# Altium project 3 Phase ESC.PrjPcb
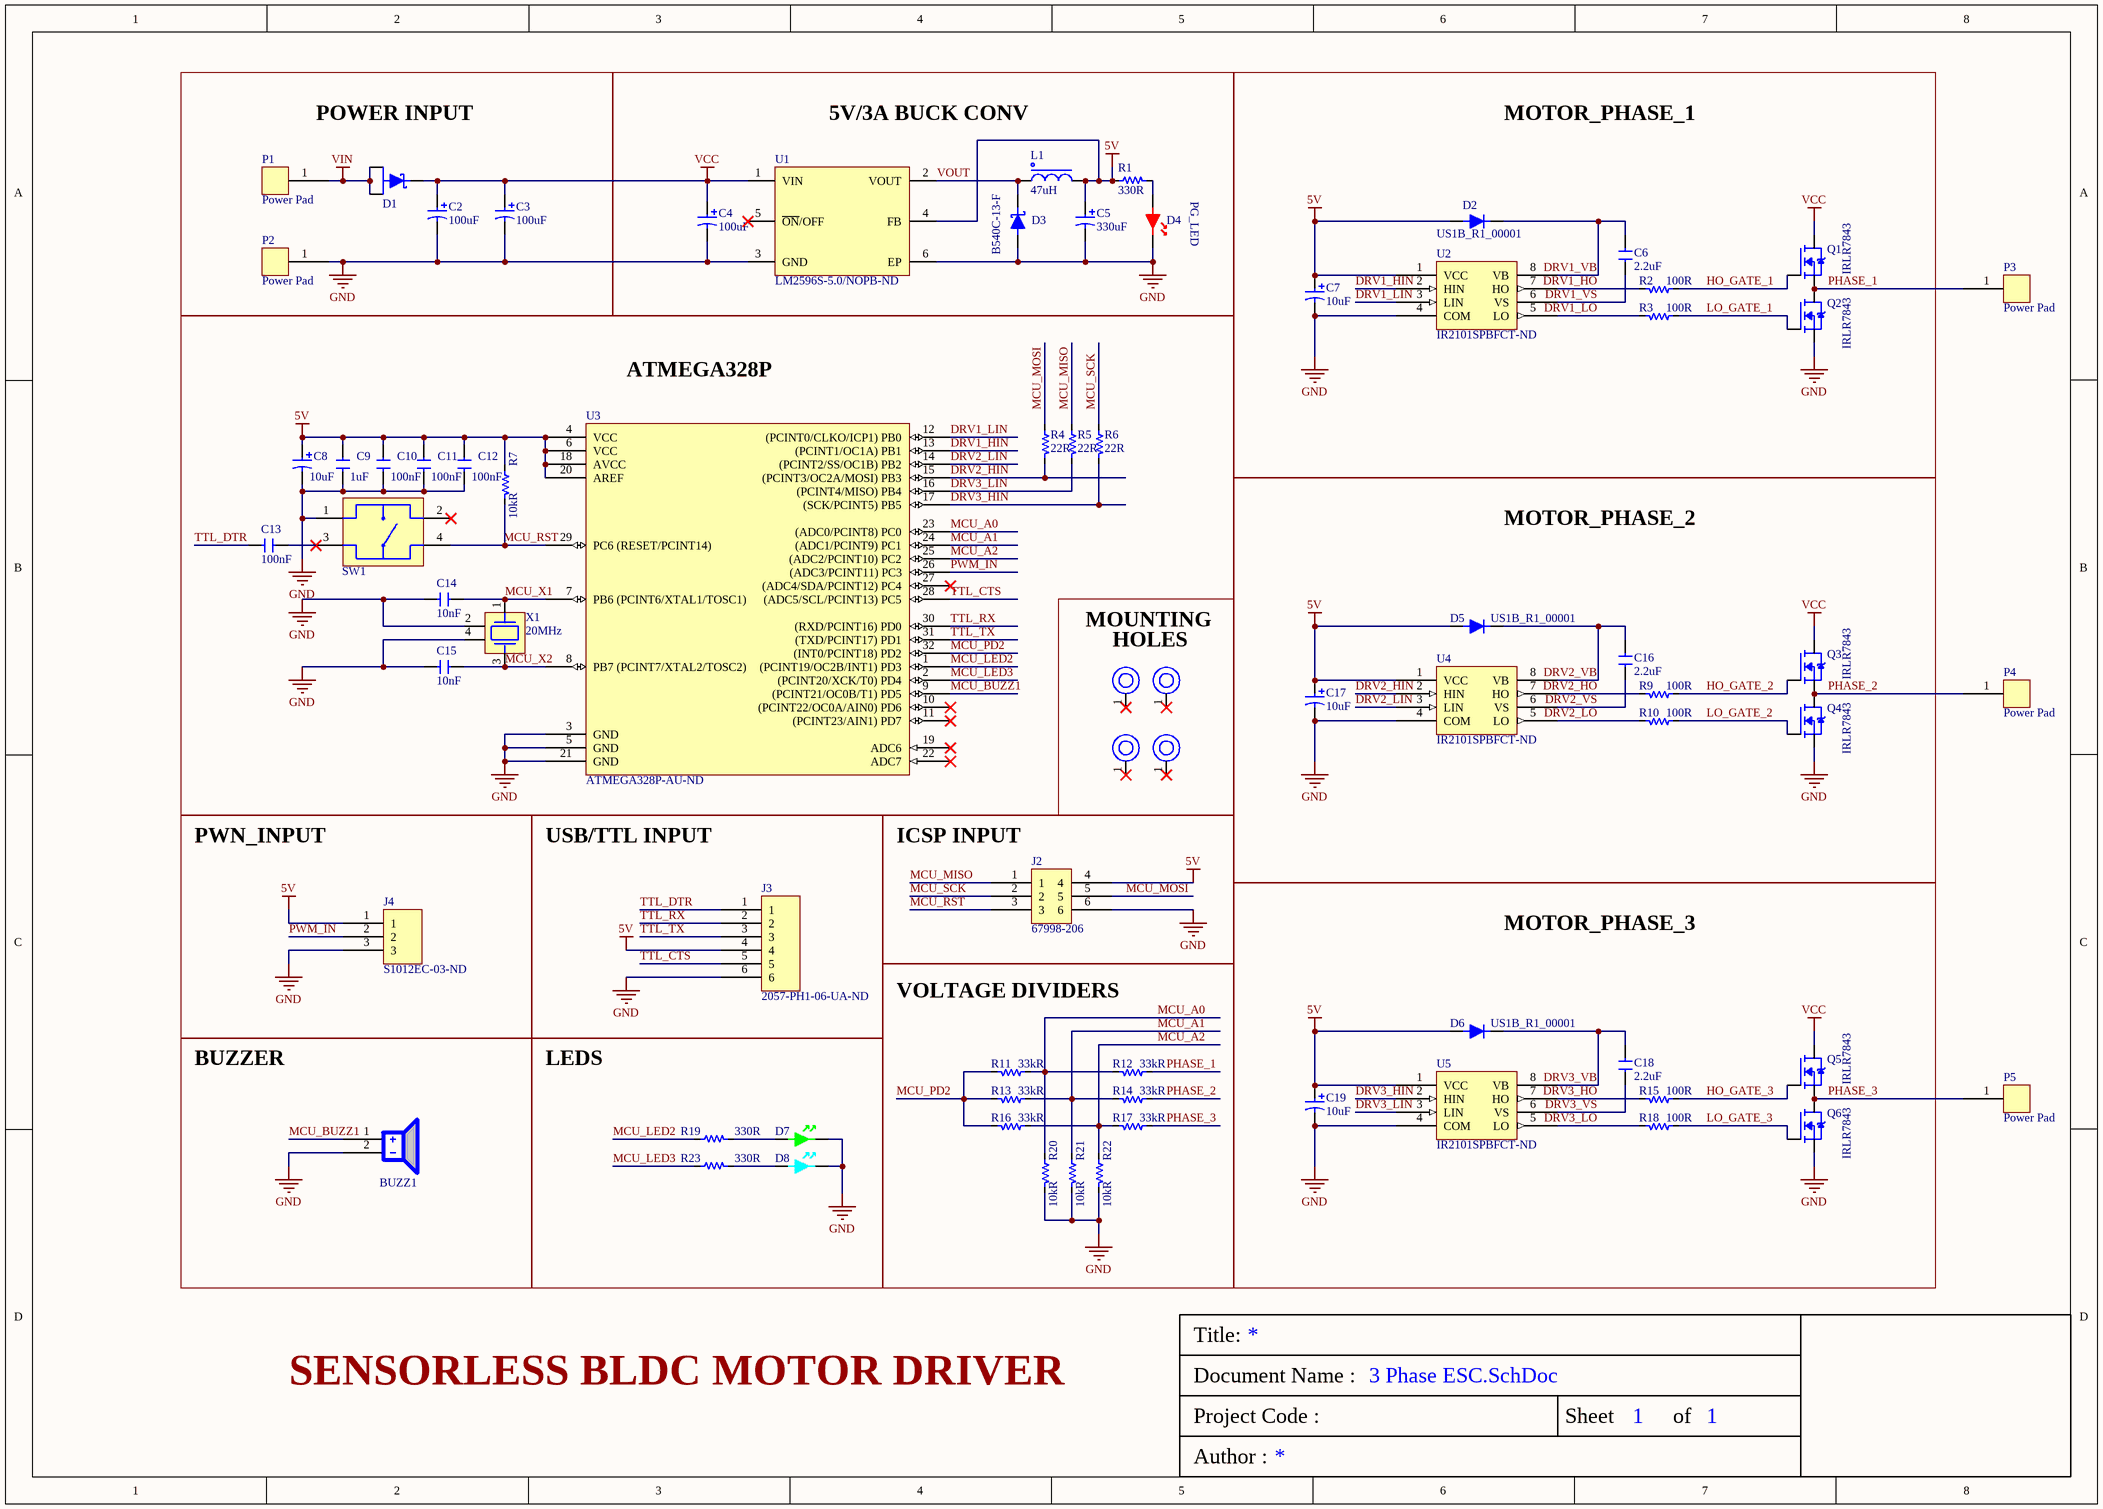
[diagram p0: 3 Phase ESC.SchDoc]
1 sheet, 75 parts. Net scope: global (net labels, ports and power ports of the same name join across sheets).
Board file: 3 Phase ESC.PcbDoc

## Sheet 3 Phase ESC.SchDoc
size A3; SheetNumber: 1; SheetTotal: 1

### Parts
BUZZ1  BUZZER  [BUZZER]  (value not drawn)
C2  Capacitance: 100uF  [RADIAL-2_10.00MMX10.00MM]  (hidden comment: BXJ63VC100MJ10TP)
C3  Capacitance: 100uF  [RADIAL-2_10.00MMX10.00MM]  (hidden comment: BXJ63VC100MJ10TP)
C4  Capacitance: 100uF  [RADIAL-2_10.00MMX10.00MM]  (hidden comment: BXJ63VC100MJ10TP)
C5  Capacitance: 330uF  [RADIAL-2_10.00MMX10.00MM]  (hidden comment: BDS35VC330MJ10TP)
C6  2.2uF  [0805_CAP]
C7  Capacitance: 10uF  [1206_TANT_CAP]  (hidden comment: CAP_10uF_10%_1206_10V_TANT)
C8  Capacitance: 10uF  [1206_TANT_CAP]  (hidden comment: CAP_10uF_10%_1206_10V_TANT)
C9  1uF  [0805_CAP]
C10  Capacitance: 100nF  [0805_CAP]  (hidden comment: CAP_0.1uF_%20_50V_0805_X7R_CER)
C11  Capacitance: 100nF  [0805_CAP]  (hidden comment: CAP_0.1uF_%20_50V_0805_X7R_CER)
C12  Capacitance: 100nF  [0805_CAP]  (hidden comment: CAP_0.1uF_%20_50V_0805_X7R_CER)
C13  Capacitance: 100nF  [0805_CAP]  (hidden comment: CAP_0.1uF_%20_50V_0805_X7R_CER)
C14  Capacitance: 10nF  [0805_CAP]  (hidden comment: CAP_10nF_%5_50V_0805_C0G_CER)
C15  Capacitance: 10nF  [0805_CAP]  (hidden comment: CAP_10nF_%5_50V_0805_C0G_CER)
C16  2.2uF  [0805_CAP]
C17  Capacitance: 10uF  [1206_TANT_CAP]  (hidden comment: CAP_10uF_10%_1206_10V_TANT)
C18  2.2uF  [0805_CAP]
C19  Capacitance: 10uF  [1206_TANT_CAP]  (hidden comment: CAP_10uF_10%_1206_10V_TANT)
D1  Diode 45V/40A  [DPAK275P1410X480-3N]  (value not drawn)
D2  Manufacturer Part Number: US1B_R1_00001  [DIOM5226X220N-SMA]  (hidden comment: DIODE_GENERAL_100V_1A_SMA)
D3  Manufacturer Part Number: B540C-13-F  [DIOM6959X25M_B560C-13-F]  (hidden comment: DIODE_SCHOTTKY_40V_5A_SMC)
D4  Red  [DIOC2114X07N-0805-LED-RED]  (value not drawn)
D5  Manufacturer Part Number: US1B_R1_00001  [DIOM5226X220N-SMA]  (hidden comment: DIODE_GENERAL_100V_1A_SMA)
D6  Manufacturer Part Number: US1B_R1_00001  [DIOM5226X220N-SMA]  (hidden comment: DIODE_GENERAL_100V_1A_SMA)
D7  Green  [DIOC2114X07N-0805-LED-GREEN]  (value not drawn)
D8  Blue  [DIOC2114X07N-0805-LED-BLUE]  (value not drawn)
J2  Supplier Part Number 1: 67998-206  [DIP_2X3_MALE_HEADER_2.54_PITCH]  (hidden comment: 2x3 Male HDR)
J3  Supplier Part Number 1: 2057-PH1-06-UA-ND  [DIP_1X6_MALE_HEADER_2.54_PITCH]  (hidden comment: 1x6 Male HDR)
J4  Supplier Part Number 1: S1012EC-03-ND  [DIP_1X3_MALE_HEADER_2.54_PITCH]  (hidden comment: CONN_1X3_2.54mm_Male Header)
L1  Inductance: 47uH  [INDP120120X800N]  (hidden comment: IND_47uH_4.3A_100mOHM_12X12MM_SMD)
MH1  Mounting Hole  [MOUNTING_HOLE]  (value not drawn)
MH2  Mounting Hole  [MOUNTING_HOLE]  (value not drawn)
MH3  Mounting Hole  [MOUNTING_HOLE]  (value not drawn)
MH4  Mounting Hole  [MOUNTING_HOLE]  (value not drawn)
P1  Power Pad  [POWER_SOLDER_PAD]  (no BOM)
P2  Power Pad  [POWER_SOLDER_PAD]  (no BOM)
P3  Power Pad  [POWER_SOLDER_PAD]  (no BOM)
P4  Power Pad  [POWER_SOLDER_PAD]  (no BOM)
P5  Power Pad  [POWER_SOLDER_PAD]  (no BOM)
Q1  IRLR7843  [DPAK229P991X239-3N]
Q2  IRLR7843  [DPAK229P991X239-3N]
Q3  IRLR7843  [DPAK229P991X239-3N]
Q4  IRLR7843  [DPAK229P991X239-3N]
Q5  IRLR7843  [DPAK229P991X239-3N]
Q6  IRLR7843  [DPAK229P991X239-3N]
R1  Resistance: 330R  [0805_RES]  (hidden comment: RES_330 OHM_5%_0805_1/8W)
R2  Resistance: 100R  [0805_RES]  (hidden comment: RES_100 OHM_1%_0805_1/8W)
R3  Resistance: 100R  [0805_RES]  (hidden comment: RES_100 OHM_1%_0805_1/8W)
R4  Resistance: 22R  [0805_RES]  (hidden comment: RES_22 OHM_1%_1/8W_0805)
R5  Resistance: 22R  [0805_RES]  (hidden comment: RES_22 OHM_1%_1/8W_0805)
R6  Resistance: 22R  [0805_RES]  (hidden comment: RES_22 OHM_1%_1/8W_0805)
R7  Resistance: 10kR  [0805_RES]  (hidden comment: 10k Ohms)
R9  Resistance: 100R  [0805_RES]  (hidden comment: RES_100 OHM_1%_0805_1/8W)
R10  Resistance: 100R  [0805_RES]  (hidden comment: RES_100 OHM_1%_0805_1/8W)
R11  Resistance: 33kR  [0805_RES]  (hidden comment: RES_33K OHM_1%_0805_1/8W)
R12  Resistance: 33kR  [0805_RES]  (hidden comment: RES_33K OHM_1%_0805_1/8W)
R13  Resistance: 33kR  [0805_RES]  (hidden comment: RES_33K OHM_1%_0805_1/8W)
R14  Resistance: 33kR  [0805_RES]  (hidden comment: RES_33K OHM_1%_0805_1/8W)
R15  Resistance: 100R  [0805_RES]  (hidden comment: RES_100 OHM_1%_0805_1/8W)
R16  Resistance: 33kR  [0805_RES]  (hidden comment: RES_33K OHM_1%_0805_1/8W)
R17  Resistance: 33kR  [0805_RES]  (hidden comment: RES_33K OHM_1%_0805_1/8W)
R18  Resistance: 100R  [0805_RES]  (hidden comment: RES_100 OHM_1%_0805_1/8W)
R19  Resistance: 330R  [0805_RES]  (hidden comment: RES_330 OHM_5%_0805_1/8W)
R20  Resistance: 10kR  [0805_RES]  (hidden comment: 10k Ohms)
R21  Resistance: 10kR  [0805_RES]  (hidden comment: 10k Ohms)
R22  Resistance: 10kR  [0805_RES]  (hidden comment: 10k Ohms)
R23  Resistance: 330R  [0805_RES]  (hidden comment: RES_330 OHM_5%_0805_1/8W)
SW1  SWITCH_TACTILE_SPST-NO_0.05A_12V  [TACT_SWITCH_6MMX6MM]  (value not drawn)
U1  Supplier Part Number 1: LM2596S-5.0/NOPB-ND  [TO170P1524X483-6N]  (hidden comment: PMIC_LM2596S-5.0/NOPB)
U2  Supplier Part Number 1: IR2101SPBFCT-ND  [SOIC127P599X175-8N]  (hidden comment: DRIVER_IR2101)
U3  Supplier Part Number 1: ATMEGA328P-AU-ND  [ATmega8U2_QFP127P600-8N]  (hidden comment: ATMEGA328P_AU)
U4  Supplier Part Number 1: IR2101SPBFCT-ND  [SOIC127P599X175-8N]  (hidden comment: DRIVER_IR2101)
U5  Supplier Part Number 1: IR2101SPBFCT-ND  [SOIC127P599X175-8N]  (hidden comment: DRIVER_IR2101)
X1  20MHz  [4-SMD_CMOS_OSC_2.50MMX2.00]

### Blocks framed on the sheet
POWER INPUT: C2 C3 D1 P1 P2
5V/3A BUCK CONV: C4 C5 D3 D4 L1 R1 U1
MOTOR_PHASE_1: C6 C7 D2 Q1 Q2 R2 R3 U2
MOTOR_PHASE_2: C16 C17 D5 Q3 Q4 R9 R10 U4
PWN_INPUT: J4
USB/TTL INPUT: J3
ICSP INPUT: J2
MOTOR_PHASE_3: C18 C19 D6 Q5 Q6 R15 R18 U5
VOLTAGE DIVIDERS: R11-R14 R16 R17 R20-R22
BUZZER: BUZZ1
LEDS: D7 D8 R19 R23

### Nets
5V: C5.1 C7.1 C8.1 C9.2 C10.2 C11.2 C12.2 C17.1 C19.1 D2.2(ANODE) D5.2(ANODE) D6.2(ANODE) J2.4 J3.4 J4.1 L1.2 R1.2 R7.2 U1.4(FB) U2.1(VCC) U3.4(VCC) U3.6(VCC) U3.18(AVCC) U3.20(AREF) U4.1(VCC) U5.1(VCC)
GND: BUZZ1.2(-) C2.2 C3.2 C4.2 C5.2 C7.2 C8.2 C9.1 C10.1 C11.1 C12.1 C14.1 C15.1 C17.2 C19.2 D3.2(ANODE) D4.1(CATHODE) D7.1(CATHODE) D8.1(CATHODE) J2.6 J3.6 J4.3 P2.1 Q2.3(S) Q4.3(S) Q6.3(S) R20.1 R21.1 R22.1 SW1.1 U1.3(GND) U1.6(EP) U2.4(COM) U3.3(GND) U3.5(GND) U3.21(GND) U4.4(COM) U5.4(COM) X1.2(GND) X1.4(GND)
VCC: C2.1 C3.1 C4.1 D1.4(CATHODE) Q1.4(D) Q3.4(D) Q5.4(D) U1.1(VIN)
VIN: D1.1(ANODE) D1.3(ANODE) P1.1
DRV1_HIN: U2.2(HIN) U3.13((PCINT1/OC1A)_PB1)
DRV1_HO: R2.1 U2.7(HO)
DRV1_LIN: U2.3(LIN) U3.12((PCINT0/CLKO/ICP1)_PB0)
DRV1_LO: R3.1 U2.5(LO)
DRV1_VB: C6.1 D2.1(CATHODE) U2.8(VB)
DRV1_VS: C6.2 U2.6(VS)
DRV2_HIN: R4.1 U3.15((PCINT3/OC2A/MOSI)_PB3) U4.2(HIN)
DRV2_HO: R9.1 U4.7(HO)
DRV2_LIN: U3.14((PCINT2/SS/OC1B)_PB2) U4.3(LIN)
DRV2_LO: R10.1 U4.5(LO)
DRV2_VB: C16.1 D5.1(CATHODE) U4.8(VB)
DRV2_VS: C16.2 U4.6(VS)
DRV3_HIN: R6.1 U3.17((SCK/PCINT5)_PB5) U5.2(HIN)
DRV3_HO: R15.1 U5.7(HO)
DRV3_LIN: R5.1 U3.16((PCINT4/MISO)_PB4) U5.3(LIN)
DRV3_LO: R18.1 U5.5(LO)
DRV3_VB: C18.1 D6.1(CATHODE) U5.8(VB)
DRV3_VS: C18.2 U5.6(VS)
HO_GATE_1: Q1.1(G) R2.2
HO_GATE_2: Q3.1(G) R9.2
HO_GATE_3: Q5.1(G) R15.2
LO_GATE_1: Q2.1(G) R3.2
LO_GATE_2: Q4.1(G) R10.2
LO_GATE_3: Q6.1(G) R18.2
MCU_A0: R11.2 R12.1 R20.2 U3.23((ADC0/PCINT8)_PC0)
MCU_A1: R13.2 R14.1 R21.2 U3.24((ADC1/PCINT9)_PC1)
MCU_A2: R16.2 R17.1 R22.2 U3.25((ADC2/PCINT10)_PC2)
MCU_BUZZ1: BUZZ1.1(+) U3.9((PCINT21/OC0B/T1)_PD5)
MCU_LED2: R19.2 U3.1((PCINT19/OC2B/INT1)_PD3)
MCU_LED3: R23.2 U3.2((PCINT20/XCK/T0)_PD4)
MCU_MISO: J2.1 R5.2
MCU_MOSI: J2.5 R4.2
MCU_PD2: R11.1 R13.1 R16.1 U3.32((INT0/PCINT18)_PD2)
MCU_RST: J2.3 R7.1 SW1.4 U3.29(PC6_(RESET/PCINT14))
MCU_SCK: J2.2 R6.2
MCU_X1: C14.2 U3.7(PB6_(PCINT6/XTAL1/TOSC1)) X1.1
MCU_X2: C15.2 U3.8(PB7_(PCINT7/XTAL2/TOSC2)) X1.3
PHASE_1: P3.1 Q1.3(S) Q2.4(D) R12.2
PHASE_2: P4.1 Q3.3(S) Q4.4(D) R14.2
PHASE_3: P5.1 Q5.3(S) Q6.4(D) R17.2
PWM_IN: J4.2 U3.26((ADC3/PCINT11)_PC3)
TTL_CTS: J3.5 U3.28((ADC5/SCL/PCINT13)_PC5)
TTL_DTR: C13.2 J3.1
TTL_RX: J3.2 U3.30((RXD/PCINT16)_PD0)
TTL_TX: J3.3 U3.31((TXD/PCINT17)_PD1)
VOUT: D3.1(CATHODE) L1.1 U1.2(VOUT)
NetC13_1: C13.1 SW1.3
NetD4_2: D4.2(ANODE) R1.1
NetD7_2: D7.2(ANODE) R19.1
NetD8_2: D8.2(ANODE) R23.1

Not connected (* = marked no-connect by the designer): MH1 1*; MH2 1*; MH3 1*; MH4 1*; SW1 2*; U1 5(~{ON}/OFF)*; U3 10((PCINT22/OC0A/AIN0)_PD6)* 11((PCINT23/AIN1)_PD7)* 19(ADC6)* 22(ADC7)* 27((ADC4/SDA/PCINT12)_PC4)*

### Notes on the sheet
- PG_LED
- ATMEGA328P
- MOUNTING
- HOLES
- SENSORLESS BLDC MOTOR DRIVER
- Title:
- Document Name :
- Project Code :
- Sheet
- of
- Author :

### Library data of the parts
C2-C4 = CAP_100uF_20%_63V_SMD_ALUM: CAP.EL.100uF 63V 10x10 105C 5000Hrs SMD; Manufacturer: SAMYOUNG; Tolerance: %20; Ripple Current: 350mA; Voltage Rating: 63V; Dimensions: 10mmx10mm
C5 = CAP_330uF_20%_35V_SMD_ALUM: CAP.EL.330uF 35V 10x10 105C 2000Hrs SMD; Manufacturer: SAMYOUNG; Tolerance: %20; Ripple Current: 450mA; Voltage Rating: 35V; Dimensions: 10mmx10mm
C6 C16 C18 = CAP_2.2uF_%10_25V_0805_X5R_CER: CAP CER 2.2UF 25V X5R 0805; Manufacturer: Samsung; Manufacturer Part Number: CL21A225KAFNNNE; Tolerance: 10%; Supplier 1: Digi-Key; RoHS: Yes; Category: Ceramic Capacitors; Stock 1: 282255; Pricing 1: 1=0,13000, 10=0,09300, 50=0,05280, 100=0,04380, 500=0,03070, 1000=0,02541 (USD); Mount: Surface Mount; Case/Package: 0805; Case Code (Metric): 2012; Case Code (Imperial): 0805; Min Operating Temperature: -55°C; Max Operating Temperature: 85°C; Capacitance: 2.2uF; Packaging: Tape and Reel; Package Quantity: 1; Voltage Rating: 25V; Dielectric: X5R; Series: CL; Construction: Flat; Length: 2mm; Width: 0.049inch; Height: 1.25mm; Thickness: 0.053inch; Depth: 1.25mm; Radiation Hardening: No; RoHS Compliant: Yes; ComponentLink1URL: https://datasheet.ciiva.com/25798/cl21a225kafnnne-25798496.pdf?src-supplier=Digi-Key; ComponentLink1Description: https://datasheet.ciiva.com/25798/cl21a225kafnnne-25798496.pdf?src-supplier=Digi-Key; ComponentLink2URL: https://datasheet.ciiva.com/16425/samsung20passive20cl21a225kafnnne-16425804.pdf?src-supplier=Future+Electronics; ComponentLink2Description: https://datasheet.ciiva.com/16425/samsung20passive20cl21a225kafnnne-16425804.pdf?src-supplier=Future+Electronics; ComponentLink3URL: https://datasheet.ciiva.com/26838/getdatasheetpartid-745307-26838602.pdf?src-supplier=Verical; ComponentLink3Description: https://datasheet.ciiva.com/26838/getdatasheetpartid-745307-26838602.pdf?src-supplier=Verical; Supplier Part Number 1: 1276-1763-1-ND
C7 C8 C17 C19 = CAP_10uF_10%_1206_10V_TANT: Cap Tant Solid 10uF 10V A CASE 10% (3.2 X 1.6 X 1.6mm) Inward L SMD 3216-18 3 Ohm 125C T/R; Manufacturer: Kyocera AVX; Manufacturer Part Number: TAJA106K010SNJ; ESR (Equivalent Series Resistance): 3R; Leakage Current: 1uA; Polarity: Polar; Dissipation Factor: 6%; Supplier 1: Digi-Key; RoHS: Yes; Category: Tantalum Capacitors; Stock 1: 14579; Pricing 1: 1=0,31000, 10=0,21300, 50=0,14920, 100=0,12780, 500=0,09584, 1000=0,08094, 2500=0,07668 (USD); Case/Package: Molded; Number of Pins: 2; Case Code (Imperial): 1206; Case Code (Metric): 3216; Min Operating Temperature: -55°C; Max Operating Temperature: 125°C; Tolerance: 10%; Packaging: Tape and Reel; Voltage Rating: 10V; Package Quantity: 8000; Termination: SMD/SMT; Voltage Rating (DC): 10V; Series: TAJ; Construction: Flat; Length: 3.2mm; Width: 1.6mm; Height: 1.8mm; Depth: 1.6mm; Radiation Hardening: No; Lead Free: Lead Free; RoHS Compliant: Yes; ComponentLink1URL: https://datasheet.ciiva.com/12909/taj-27497-12909898.pdf?src-supplier=Mouser; ComponentLink1Description: https://datasheet.ciiva.com/12909/taj-27497-12909898.pdf?src-supplier=Mouser; Supplier Part Number 1: 478-13122-1-ND
C9 = CAP_1uF_%10_25V_0805_X7R_CER: 陶瓷电容 1uF(105) 1uF ±10% 25V 0805; Manufacturer: Samsung; Manufacturer Part Number: CL21B105KAFNNNG; Material: Ceramic; Dielectric: X7R; Supplier 1: Digi-Key; RoHS: Yes; Category: Ceramic Capacitors; Stock 1: 509034; Pricing 1: 1=0,10000, 10=0,07100, 50=0,03880, 100=0,03170, 500=0,02264, 1000=0,01779 (USD); Mount: Surface Mount; Case/Package: 0805; Case Code (Metric): 2012; Case Code (Imperial): 0805; Min Operating Temperature: -55°C; Max Operating Temperature: 125°C; Tolerance: 10%; Capacitance: 1uF; Voltage Rating: 25V; Package Quantity: 3000; Packaging: Tape and Reel; Voltage: 25V; Series: CL; Length: 2mm; Width: 0.049inch; Height: 1.25mm; Thickness: 0.053inch; Depth: 1.25mm; Radiation Hardening: No; RoHS Compliant: Yes; ComponentLink1URL: https://datasheet.ciiva.com/26920/getdatasheetpartid-698495-26920200.pdf?src-supplier=Verical; ComponentLink1Description: https://datasheet.ciiva.com/26920/getdatasheetpartid-698495-26920200.pdf?src-supplier=Verical; ComponentLink2URL: https://datasheet.ciiva.com/29199/455911-da-01-en-vs-kondensator-0805-29199043.pdf?src-supplier=Conrad; ComponentLink2Description: https://datasheet.ciiva.com/29199/455911-da-01-en-vs-kondensator-0805-29199043.pdf?src-supplier=Conrad; ComponentLink3URL: https://datasheet.ciiva.com/16428/cl05b104kq5nnnc-16428871.pdf?src-supplier=Future+Electronics; ComponentLink3Description: https://datasheet.ciiva.com/16428/cl05b104kq5nnnc-16428871.pdf?src-supplier=Future+Electronics; Supplier Part Number 1: 1276-6469-1-ND
C10-C13 = CAP_0.1uF_%20_50V_0805_X7R_CER: Cap Ceramic 0.1uF 50V X7R 20% SMD 0805 125C Paper T/R; Manufacturer: KEMET; Manufacturer Part Number: C0805C104M5RACTU; Supplier 1: Digi-Key; RoHS: Yes; Category: Ceramic Capacitors; Stock 1: 4863; Pricing 1: 1=0,10000, 10=0,06400, 50=0,03500, 100=0,02860, 500=0,02040, 1000=0,01603 (USD); Mount: Surface Mount; Case/Package: 0805; Dielectric Material: Ceramic; Min Operating Temperature: -55°C; Max Operating Temperature: 125°C; Tolerance: 20%; Dielectric: X7R; Packaging: Tape and Reel; Voltage Rating (DC): 50V; Length: 2mm; Height: 0.9mm; Depth: 1.25mm; Radiation Hardening: No; ComponentLink1URL: http://uk.rs-online.com/webdocs/13da/0900766b813daa06.pdf?src-supplier=RSComponents; ComponentLink1Description: http://uk.rs-online.com/webdocs/13da/0900766b813daa06.pdf?src-supplier=RSComponents; ComponentLink2URL: https://www.verical.com/server-webapp/html/getDatasheet?partID=774625&src-supplier=Verical; ComponentLink2Description: https://www.verical.com/server-webapp/html/getDatasheet?partID=774625&src-supplier=Verical; ComponentLink3URL: http://www.farnell.com/datasheets/2739857.pdf?src-supplier=Farnell; ComponentLink3Description: http://www.farnell.com/datasheets/2739857.pdf?src-supplier=Farnell; ComponentLink4URL: http://uk.rs-online.com/webdocs/1515/0900766b81515223.pdf?src-supplier=RSComponents; ComponentLink4Description: http://uk.rs-online.com/webdocs/1515/0900766b81515223.pdf?src-supplier=RSComponents; ComponentLink5URL: http://components.arrow.com/part/dataview/0323_00324812?src-supplier=Arrow+Europe; ComponentLink5Description: http://components.arrow.com/part/dataview/0323_00324812?src-supplier=Arrow+Europe; ComponentLink6URL: http://uk.rs-online.com/webdocs/1528/0900766b81528e2f.pdf?src-supplier=RSComponents; ComponentLink6Description: http://uk.rs-online.com/webdocs/1528/0900766b81528e2f.pdf?src-supplier=RSComponents; ComponentLink7URL: http://www.farnell.com/datasheets/2739857.pdf?src-supplier=Newark; ComponentLink7Description: http://www.farnell.com/datasheets/2739857.pdf?src-supplier=Newark; ComponentLink8URL: http://www.alliedelec.com/m/d/9bfe7773041ffe9d406e68bc7b377fdd.pdf?src-supplier=Allied+Electronics; ComponentLink8Description: http://www.alliedelec.com/m/d/9bfe7773041ffe9d406e68bc7b377fdd.pdf?src-supplier=Allied+Electronics; ComponentLink9URL: https://api.kemet.com/component-edge/download/datasheet/C0805C104M5RACTU.pdf?src-supplier=Digi-Key; ComponentLink9Description: https://api.kemet.com/component-edge/download/datasheet/C0805C104M5RACTU.pdf?src-supplier=Digi-Key; ComponentLink10URL: http://capacitoredge.kemet.com/capedge2/DataSheet?pn=C0805C104M5RACTU&src-supplier=Avnet+Europe; ComponentLink10Description: http://capacitoredge.kemet.com/capedge2/DataSheet?pn=C0805C104M5RACTU&src-supplier=Avnet+Europe; ComponentLink11URL: http://www.farnell.com/datasheets/2739857.pdf?src-supplier=Element14; ComponentLink11Description: http://www.farnell.com/datasheets/2739857.pdf?src-supplier=Element14; ComponentLink12URL: http://www.mouser.com/ds/2/212/KEM_C1002_X7R_SMD-1102033.pdf?src-supplier=Mouser; ComponentLink12Description: http://www.mouser.com/ds/2/212/KEM_C1002_X7R_SMD-1102033.pdf?src-supplier=Mouser; ComponentLink13URL: https://www.verical.com/server-webapp/html/getDatasheet?partID=91523&src-supplier=Verical; ComponentLink13Description: https://www.verical.com/server-webapp/html/getDatasheet?partID=91523&src-supplier=Verical; ComponentLink14URL: http://components.arrow.com/part/dataview/2091108S8109171N7429?src-supplier=Arrow+Electronics; ComponentLink14Description: http://components.arrow.com/part/dataview/2091108S8109171N7429?src-supplier=Arrow+Electronics; Supplier Part Number 1: 399-C0805C104M5RAC7800CT-ND
C14 C15 = CAP_10nF_%5_50V_0805_C0G_CER: CGA Series 0805 10 nF 50 V ±5 % Tolerance C0G SMT Multilayer Ceramic Capacitor; Manufacturer: TDK; Manufacturer Part Number: CGA4C2C0G1H103J060AA; Tolerance: 5%; Voltage Rating: 50V; Supplier 1: Digi-Key; RoHS: Yes; Category: Ceramic Capacitors; Stock 1: 35061; Pricing 1: 1=0,32000, 10=0,21800, 50=0,14520, 100=0,12340, 500=0,08712, 1000=0,07623 (USD); Mount: Surface Mount; Case/Package: 0805; Case Code (Metric): 2012; Case Code (Imperial): 0805; Weight: 0.000194oz; Min Operating Temperature: -55°C; Max Operating Temperature: 125°C; Packaging: Tape and Reel; Package Quantity: 1; Voltage Rating (DC): 50V; Dielectric: C0G; Termination: SMD/SMT; Resistor Type: Ceramic; Series: CGA; Length: 2mm; Width: 0.049inch; Height: 0.6mm; Thickness: 0.028inch; Depth: 1.25mm; Ratings: AEC-Q200; Radiation Hardening: No; REACH SVHC: No SVHC; Lead Free: Lead Free; RoHS Compliant: Yes; ComponentLink1URL: https://datasheet.ciiva.com/15215/getdatasheetpartid-712412-15215921.pdf?src-supplier=Verical; ComponentLink1Description: https://datasheet.ciiva.com/15215/getdatasheetpartid-712412-15215921.pdf?src-supplier=Verical; ComponentLink2URL: https://datasheet.ciiva.com/24219/cga4c2c0g1h103j060aa-265903-24219348.pdf?src-supplier=Mouser; ComponentLink2Description: https://datasheet.ciiva.com/24219/cga4c2c0g1h103j060aa-265903-24219348.pdf?src-supplier=Mouser; Supplier Part Number 1: 445-6947-1-ND
D1 = DIODE_SCHOTTKY_45V_40A_TO263: Diode Schottky 45V 40A 3-Pin TO-263 T/R; Manufacturer: Panjit; Manufacturer Part Number: SBM4045LDC_R2_00001; Supplier 1: Mouser; Pricing 1: 1=1,48000, 10=1,34000, 50=1,34000, 100=1,04000, 1000=0,67700, 10000=0,63100 (USD); Supplier Part Number 1: 241-SBM4045LDCR20000
D2 D5 D6 = DIODE_GENERAL_100V_1A_SMA: Si-diode 1A 100V Sma; Manufacturer: Pan Jit; Max Reverse Current: 1uA; Reverse Recovery Time: 50ns; Peak Non-Repetitive Surge Current: 30A; Element Configuration: Single; Supplier 1: Digi-Key; RoHS: Yes; Category: Rectifier Diodes; Stock 1: 5400; Pricing 1: 1=0,42000, 10=0,34100, 100=0,18060, 500=0,11880 (USD); Mount: Surface Mount; Case/Package: SMA; Min Operating Temperature: -55°C; Max Operating Temperature: 150°C; Forward Current: 1A; Max Repetitive Reverse Voltage (Vrrm): 100V; RoHS Compliant: Yes; Supplier Part Number 1: 3757-US1B_R1_00001CT-ND
D3 = DIODE_SCHOTTKY_40V_5A_SMC: VR=40V IF=5A 300pF; Manufacturer: Diodes; Forward Current: 5A; Max Repetitive Reverse Voltage (Vrrm): 40V; Element Configuration: Single; Max Reverse Current: 500uA; Peak Non-Repetitive Surge Current: 100A; Forward Voltage: 550mV; Polarity: Standard; Supplier 1: Digi-Key; RoHS: Yes; Category: Rectifier Diodes; Mount: Surface Mount; Case/Package: SMC; Number of Pins: 2; Weight: 0.007408oz; Contact Plating: Tin,Matte; Min Operating Temperature: -55°C; Max Operating Temperature: 125°C; Packaging: Cut Tape; Max Forward Surge Current (Ifsm): 100A; Package Quantity: 3000; Average Rectified Current: 5A; Termination: SMD/SMT; Voltage Rating (DC): 40V; Current Rating: 5A; Capacitance: 300pF; Output Current: 5A; Max Reverse Voltage (DC): 40V; Series: B520C/CQ - B560C/CQ; Current: 5A; Voltage: 40V; Length: 7.11mm; Width: 6.22mm; Height: 2.5mm; Radiation Hardening: No; REACH SVHC: No SVHC; Lead Free: Lead Free; RoHS Compliant: Yes; Supplier Part Number 1: B540C-FDICT-ND
D4 = LED_RED CLEAR_2SMD/0805: Led Red Clear 2SMD; Manufacturer: Everlight; Manufacturer Part Number: EAST2012RA1; Lens Color: Colorless; Luminous Intensity: 79mcd; Test Current: 20mA; Viewing Angle: 120°; Dominant Wavelength: 626nm; Forward Voltage: 2V; Supplier 1: Digi-Key; Category: LEDs; Stock 1: 154; Pricing 1: 1=0,23000, 10=0,12300, 100=0,05840, 500=0,04996, 1000=0,03842 (USD); Mount: Surface Mount; Case/Package: 0805; Color: Red; Packaging: Tape and Reel; Lens Transparency: Clear; Length: 2mm; Width: 1.25mm; Height: 1mm; RoHS Compliant: Yes; ComponentLink1URL: http://www.mouser.com/ds/2/143/EAST2012RA1-707412.pdf?src-supplier=Mouser; ComponentLink1Description: http://www.mouser.com/ds/2/143/EAST2012RA1-707412.pdf?src-supplier=Mouser; ComponentLink2URL: https://everlightamericas.com/index.php?controller=attachment&id_attachment=1047&src-supplier=Digi-Key; ComponentLink2Description: https://everlightamericas.com/index.php?controller=attachment&id_attachment=1047&src-supplier=Digi-Key; Supplier Part Number 1: 1080-EAST2012RA1CT-ND
D7 = LED_GREEN CLEAR_2SMD/0805: Led Green Clear 2SMD; Manufacturer: Everlight; Manufacturer Part Number: EAST2012GA5; Lens Color: Colorless; Luminous Intensity: 315mcd; Test Current: 20mA; Viewing Angle: 140°; Dominant Wavelength: 523nm; Forward Voltage: 3.4V; Supplier 1: Digi-Key; Category: LEDs; Stock 1: 15531; Pricing 1: 1=0,44000, 10=0,29000, 100=0,19380, 500=0,13406, 1000=0,11172 (USD); Mount: Surface Mount; Case/Package: 0805; Color: Green; Packaging: Tape and Reel; Lens Transparency: Clear; Length: 2mm; Width: 1.25mm; Height: 1mm; RoHS Compliant: Yes; ComponentLink1URL: http://www.mouser.com/ds/2/143/EAST2012GA5-707028.pdf?src-supplier=Mouser; ComponentLink1Description: http://www.mouser.com/ds/2/143/EAST2012GA5-707028.pdf?src-supplier=Mouser; ComponentLink2URL: https://everlightamericas.com/index.php?controller=attachment&id_attachment=1042&src-supplier=Digi-Key; ComponentLink2Description: https://everlightamericas.com/index.php?controller=attachment&id_attachment=1042&src-supplier=Digi-Key; Supplier Part Number 1: 1080-EAST2012GA5CT-ND
D8 = LED_BLUE CLEAR_2SMD/0805: Blue 0805 140° 112 mcd Clear 3.3 V Surface Mount LED; Manufacturer: Everlight; Manufacturer Part Number: EAST2012BA2; Lens Color: Colorless; Luminous Intensity: 79mcd; Test Current: 20mA; Dominant Wavelength: 471nm; Forward Voltage: 3.3V; Supplier 1: Digi-Key; RoHS: Yes; Category: LEDs; Pricing 1: 9000=0,05724 (USD); Mount: Surface Mount; Case/Package: 0805; Color: Blue; Packaging: Tape and Reel; Lens Transparency: Clear; Viewing Angle: 140°; Length: 2mm; Width: 1.25mm; Height: 1.1mm; Lead Free: Lead Free; RoHS Compliant: Yes; ComponentLink1URL: http://www.mouser.com/ds/2/143/EAST2012BA2-707392.pdf?src-supplier=Mouser; ComponentLink1Description: http://www.mouser.com/ds/2/143/EAST2012BA2-707392.pdf?src-supplier=Mouser; ComponentLink2URL: https://everlightamericas.com/index.php?controller=attachment&id_attachment=1036&src-supplier=Digi-Key; ComponentLink2Description: https://everlightamericas.com/index.php?controller=attachment&id_attachment=1036&src-supplier=Digi-Key; Supplier Part Number 1: EAST2012BA2-ND
J2 = CONN_2X3_2.54mm_Male Header: Conn Unshrouded Header HDR 6 POS 2.54mm Solder ST Thru-Hole Poly Bag; Manufacturer: Amphenol ICC / FCI; Supplier 1: Avnet; Manufacturer Part Number: 67998-206; Category: Headers and Wire Housings; Pricing 1: 4800=0,21933, 5600=0,21344, 10400=0,20314, 24000=0,19578, 48000=0,18989, 240000=0,18400, 480000=0,17958 (USD); ComponentLink1URL: http://portal.fciconnect.com/Comergent//fci/drawing/67996.pdf?src-supplier=Digi-Key; ComponentLink1Description: http://portal.fciconnect.com/Comergent//fci/drawing/67996.pdf?src-supplier=Digi-Key; ComponentLink2URL: http://portal.fciconnect.com/Comergent/fci/drawing/67996.pdf?src-supplier=Avnet; ComponentLink2Description: http://portal.fciconnect.com/Comergent/fci/drawing/67996.pdf?src-supplier=Avnet
J3 = CONN_1X6_2.54m_Male Header: PH Series 6 Position Through Hole Single Row Straight .100 Header; Manufacturer: Adam Equipment; Manufacturer Part Number: PH1-06-UA; Number of Positions: 6; Pitch: 2.54mm; Supplier 1: Digi-Key; RoHS: Yes; Category: Connectors; Stock 1: 1029; Pricing 1: 1=0,13000, 10=0,10000, 100=0,07370, 500=0,06098, 1000=0,05336, 5000=0,04574, 10000=0,04447 (USD); Mount: Through Hole; Contact Plating: Gold; Number of Contacts: 6; Packaging: Bag; Number of Rows: 1; Lead Free: Lead Free; ComponentLink1URL: http://www.adam-tech.com/catalog/2012/page_312-315.pdf?src-supplier=Future+Electronics; ComponentLink1Description: http://www.adam-tech.com/catalog/2012/page_312-315.pdf?src-supplier=Future+Electronics
J4 = CONN_1X3_2.54mm_Male Header: Conn Header Vert 3POS 2.54MM; Manufacturer: Sullins; Manufacturer Part Number: PREC003SAAN-RC; Number of Positions: 3; Connector Type: Male Pin; Pitch: 0.1inch; Supplier 1: Digi-Key; RoHS: Yes; Category: Connectors; Stock 1: 15048; Pricing 1: 1=0,09000, 10=0,08400, 25=0,06240, 50=0,05340, 100=0,05170, 250=0,04456, 500=0,04276 (USD); Mount: Through Hole; Color: Black; Contact Plating: Tin; Package Quantity: 1; Number of Rows: 1; Packaging: Bulk; Termination: Solder; Series: -; Contact Type: Male Pin; Contact Mating Length: 0.23inch; RoHS Compliant: Yes; ComponentLink1URL: https://datasheet.ciiva.com/740/zrzczzzszzn-rc-st-11635-b-740842.pdf?src-supplier=Digi-Key; ComponentLink1Description: https://datasheet.ciiva.com/740/zrzczzzszzn-rc-st-11635-b-740842.pdf?src-supplier=Digi-Key
L1 = IND_47uH_4.3A_100mOHM_12X12MM_SMD: INDUCTOR POWER 47UH 12X12MM SMD; Manufacturer: CORE MASTER; Manufacturer Part Number: SRI1207-470M; Current Rating: 4.3A; Tolerance: 20%; DC Resistance (DCR): 100mR
MH1-MH4 = MOUNTING_HOLE
P1-P5 = POWER_PAD
Q1-Q6 = MOSFET_IRLR7843TRPBF: MOSFET N-CH 30V 161A DPAK; Manufacturer: Infineon; Rds On Max: 3.3mR; Input Capacitance: 4.38nF; Max Power Dissipation: 140W; Rise Time: 42ns; Gate to Source Voltage (Vgs): 20V; Turn-Off Delay Time: 34ns; Turn-On Delay Time: 25ns; Threshold Voltage: 2.3V; Supplier 1: Digi-Key; Manufacturer Part Number: IRLR7843TRPBF; RoHS: Yes; Category: MOSFETs; Stock 1: 5978; Pricing 1: 1=1,73000, 10=1,54800, 100=1,20670, 500=0,99682, 1000=0,87440 (USD); Mount: Surface Mount; Case/Package: TO-252-3; Number of Pins: 3; Contact Plating: Tin,Matte; Min Operating Temperature: -55°C; Max Operating Temperature: 175°C; Packaging: Cut Tape; Continuous Drain Current (ID): 161A; Drain to Source Voltage (Vdss): 30V; Power Dissipation: 140W; Drain to Source Breakdown Voltage: 30V; Drain to Source Resistance: 3.3mR; Max Dual Supply Voltage: 30V; Length: 0.264inch; Width: 0.245inch; Height: 0.094inch; RoHS Compliant: Yes; REACH SVHC: No SVHC; Lead Free: Contains Lead; Halogen Free: Halogen Free; ComponentLink1URL: http://www.farnell.com/datasheets/107858.pdf?src-supplier=Farnell; ComponentLink1Description: http://www.farnell.com/datasheets/107858.pdf?src-supplier=Farnell; ComponentLink2URL: https://www.alliedelec.com/m/d/e4530362cf37d0e7350522b44819c1b2.pdf?src-supplier=Allied+Electronics; ComponentLink2Description: https://www.alliedelec.com/m/d/e4530362cf37d0e7350522b44819c1b2.pdf?src-supplier=Allied+Electronics; ComponentLink3URL: http://www.farnell.com/datasheets/107858.pdf?src-supplier=Element14; ComponentLink3Description: http://www.farnell.com/datasheets/107858.pdf?src-supplier=Element14; ComponentLink4URL: https://www.infineon.com/dgdl/irlr7843pbf.pdf?fileId=5546d462533600a40153566de53526d8&src-supplier=Digi-Key; ComponentLink4Description: https://www.infineon.com/dgdl/irlr7843pbf.pdf?fileId=5546d462533600a40153566de53526d8&src-supplier=Digi-Key; ComponentLink5URL: http://www.infineon.com/dgdl/irlr7843pbf.pdf?fileId=5546d462533600a40153566de53526d8&src-supplier=Digi-Key; ComponentLink5Description: http://www.infineon.com/dgdl/irlr7843pbf.pdf?fileId=5546d462533600a40153566de53526d8&src-supplier=Digi-Key; Supplier Part Number 1: IRLR7843PBFCT-ND
R1 R19 R23 = RES_330 OHM_5%_0805_1/8W: Res Thick Film 0805 330 Ohm 5% 0.125W(1/8W) ±100ppm/C Pad SMD Automotive T/R; Manufacturer: TE Connectivity; Manufacturer Part Number: CRGCQ0805J330R; Supplier 1: Digi-Key; RoHS: Yes; Category: Chip SMD Resistors; Stock 1: 75221; Pricing 1: 1=0,10000, 10=0,04400, 100=0,01780, 1000=0,00798, 2500=0,00693 (USD); ComponentLink1URL: https://www.te.com/commerce/DocumentDelivery/DDEController?Action=srchrtrv&amp;DocNm=1773204-3&amp;DocType=DS&amp;DocLang=English&src-supplier=Digi-Key; ComponentLink1Description: https://www.te.com/commerce/DocumentDelivery/DDEController?Action=srchrtrv&amp;DocNm=1773204-3&amp;DocType=DS&amp;DocLang=English&src-supplier=Digi-Key; Supplier Part Number 1: A130131CT-ND
R2 R3 R9 R10 R15 R18 = RES_100 OHM_1%_0805_1/8W: 贴片电阻 100Ω ± 1.00% 0.125W ± 100ppm/℃ 0805; Manufacturer: Yageo; Manufacturer Part Number: RC0805FR-07100RL; Power Rating: 125mW; Tolerance: 1%; Voltage Rating: 150V; Temperature Coefficient: 100ppm/°C; Application(s): HIGH RELIABILITY; Supplier 1: Digi-Key; RoHS: Yes; Category: Chip SMD Resistors; Stock 1: 3418646; Pricing 1: 1=0,10000, 10=0,04200, 100=0,01690, 1000=0,00759, 2500=0,00659 (USD); Case/Package: 0805; Number of Pins: 2; Case Code (Imperial): 0805; Case Code (Metric): 2012; Weight: 0.000917oz; Min Operating Temperature: -55°C; Max Operating Temperature: 155°C; Packaging: Cut Tape; Package Quantity: 5000; Termination: SMD/SMT; Resistor Type: Thick Film; Number of Terminations: 2; Max Power Dissipation: 125mW; Features: Moisture Resistant; Series: RC; Technology: THICK FILM; Voltage Rating (DC): 150V; Type: General Purpose; Length: 2mm; Width: 1.25mm; Height: 0.5mm; Depth: 1.25mm; Lead Pitch: 0.4mm; REACH SVHC: Unknown; Lead Free: Lead Free; RoHS Compliant: Yes; Military Standard: Not; ComponentLink1URL: https://datasheet.ciiva.com/11808/0900766b8106beab-11808877.pdf?src-supplier=RSComponents; ComponentLink1Description: https://datasheet.ciiva.com/11808/0900766b8106beab-11808877.pdf?src-supplier=RSComponents; ComponentLink2URL: https://datasheet.ciiva.com/7941/1697719-7941680.pdf?src-supplier=Element14; ComponentLink2Description: https://datasheet.ciiva.com/7941/1697719-7941680.pdf?src-supplier=Element14; ComponentLink3URL: https://datasheet.ciiva.com/7660/38627-7660797.pdf?src-supplier=Element14; ComponentLink3Description: https://datasheet.ciiva.com/7660/38627-7660797.pdf?src-supplier=Element14; ComponentLink4URL: https://datasheet.ciiva.com/2456/pyu-r-int-thick-7-2456987.pdf?src-supplier=Digi-Key; ComponentLink4Description: https://datasheet.ciiva.com/2456/pyu-r-int-thick-7-2456987.pdf?src-supplier=Digi-Key; Supplier Part Number 1: 311-100CRCT-ND
R4-R6 = RES_22 OHM_1%_1/8W_0805: Res Thick Film 0805 22 Ohm 1% 0.125W(1/8W) ±100ppm/C Pad SMD T/R; Manufacturer: Vishay Dale; Manufacturer Part Number: CRCW080522R0FKEAC; Max Power Dissipation: 125mW; Temperature Coefficient: 100ppm/°C; Supplier 1: Digi-Key; RoHS: Yes; Stock 1: 199510; Pricing 1: 1=0,10000, 10=0,06300, 100=0,02540, 1000=0,01143, 2500=0,00992 (USD); Case/Package: 0805; Case Code (Imperial): 0805; Case Code (Metric): 2012; Min Operating Temperature: -55°C; Max Operating Temperature: 155°C; Resistor Type: Thick Film; Packaging: Tape and Reel; Tolerance: 1%; Number of Terminations: 2; RoHS Compliant: Yes; ComponentLink1URL: http://www.vishay.com/docs/28773/crcwce3.pdf?src-supplier=Digi-Key; ComponentLink1Description: http://www.vishay.com/docs/28773/crcwce3.pdf?src-supplier=Digi-Key; Supplier Part Number 1: 541-4151-1-ND
R7 R20-R22 = RES_10K OHM_%1_0805_1/8W: Res SMD 0805 10K 1% 0.125W T.C.100PPM; Manufacturer: TDK; Manufacturer Part Number: C2012X7R1H104K085AA; Dielectric Material: Ceramic; Capacitance: 100nF; Tolerance: 10%; Dielectric: X7R; Voltage Rating: 50V; Temperature Coefficient: 100ppm/°C; Power Rating: 125mW; Supplier 1: Digi-Key; RoHS: Yes; Category: Ceramic Capacitors; Stock 1: 54853; Pricing 1: 1=0,15000, 10=0,10900, 50=0,06160, 100=0,05100, 500=0,03578, 1000=0,02962 (USD); Mount: Surface Mount; Case/Package: 0805; Number of Pins: 2; Case Code (Metric): 2012; Case Code (Imperial): 0805; Weight: 0.000194oz; Min Operating Temperature: -55°C; Max Operating Temperature: 125°C; Packaging: Tape and Reel; Voltage Rating (DC): 50V; Termination: SMD/SMT; Construction: Flat; Package Quantity: 1; Resistor Type: Ceramic; Voltage: 50V; Series: C; Length: 2mm; Width: 0.049inch; Height: 0.85mm; Depth: 1.25mm; Thickness: 0.037inch; Radiation Hardening: No; RoHS Compliant: Yes; REACH SVHC: No SVHC; Lead Free: Lead Free; ComponentLink1URL: https://datasheet.ciiva.com/11788/0900766b80c1bb00-11788128.pdf?src-supplier=RSComponents; ComponentLink1Description: https://datasheet.ciiva.com/11788/0900766b80c1bb00-11788128.pdf?src-supplier=RSComponents; ComponentLink2URL: https://datasheet.ciiva.com/6250/tdkmlcccaprange-6250821.pdf?src-supplier=Digi-Key; ComponentLink2Description: https://datasheet.ciiva.com/6250/tdkmlcccaprange-6250821.pdf?src-supplier=Digi-Key; ComponentLink3URL: https://datasheet.ciiva.com/24191/e412-c-24191447.pdf?src-supplier=Future+Electronics; ComponentLink3Description: https://datasheet.ciiva.com/24191/e412-c-24191447.pdf?src-supplier=Future+Electronics; ComponentLink4URL: https://datasheet.ciiva.com/6250/tdkmlcccaprange-6250824.pdf?src-supplier=Digi-Key; ComponentLink4Description: https://datasheet.ciiva.com/6250/tdkmlcccaprange-6250824.pdf?src-supplier=Digi-Key; ComponentLink5URL: https://datasheet.ciiva.com/23803/1796654-23803035.pdf?src-supplier=Newark; ComponentLink5Description: https://datasheet.ciiva.com/23803/1796654-23803035.pdf?src-supplier=Newark; ComponentLink6URL: https://datasheet.ciiva.com/28602/1571323-28602204.pdf?src-supplier=Element14; ComponentLink6Description: https://datasheet.ciiva.com/28602/1571323-28602204.pdf?src-supplier=Element14; Supplier Part Number 1: 445-7534-1-ND; Supplier 2: Digi-Key; Stock 2: 3512962; Pricing 2: 1=0,10000, 10=0,04200, 100=0,01690, 1000=0,00759, 2500=0,00659 (USD); Size Code: 0805; Number of Terminations: 2; Max Power Dissipation: 125mW; Features: Moisture Resistant; Resistance Tolerance: 1%; Technology: THICK FILM; Military Standard: Not; Supplier Part Number 2: 311-10.0KCRCT-ND
R11-R14 R16 R17 = RES_33K OHM_1%_0805_1/8W: CRCW Thick Film Commodity Chip Resistor 0805 Size 33K Ohm 1% 0.125 W 100 ppm/K 2-Pin SMD Paper T/R; Manufacturer: Vishay Dale; Manufacturer Part Number: CRCW080533K0FKEBC; Max Power Dissipation: 125mW; Temperature Coefficient: 100ppm/°C; Supplier 1: Digi-Key; RoHS: Yes; Stock 1: 39990; Pricing 1: 1=0,10000, 10=0,06300, 100=0,02540, 1000=0,01143, 2500=0,00992, 5000=0,00819 (USD); Case/Package: 0805; Min Operating Temperature: -55°C; Max Operating Temperature: 155°C; Resistor Type: Thick Film; Packaging: Tape and Reel; Tolerance: 1%; Number of Terminations: 2; RoHS Compliant: Yes; ComponentLink1URL: http://www.vishay.com/docs/28773/crcwce3.pdf?src-supplier=Digi-Key; ComponentLink1Description: http://www.vishay.com/docs/28773/crcwce3.pdf?src-supplier=Digi-Key; Supplier Part Number 1: 541-CRCW080533K0FKEBCCT-ND
SW1 = SWITCH_TACTILE_SPST-NO_0.05A_12V: Switch Tactile N.O. SPST Round Button Gull Wing 0.05A 12VDC 100000Cycles 1.27N SMD T/R; Manufacturer: ITT C&K; Manufacturer Part Number: PTS645SL43SMTR92LFS; Actuator Material: Nylon,Polyamide,PA66; Max Voltage Rating (DC): 12V; Contact Resistance: 100mR; Max Current Rating: 50mA; Illumination Type: Non-Illuminated; Switch Function: Off-Mom; Actuator Type: Standard; Actuator Length: 0.85mm; Supplier 1: Digi-Key; RoHS: Yes; Category: Tactile Switches; Stock 1: 52166; Pricing 1: 1=0,15000, 10=0,14900, 25=0,14160, 100=0,12870, 250=0,12104, 500=0,11072 (USD); Mount: Surface Mount; Contact Material: Bronze,Brass,Silver; Contact Plating: Silver; Mechanical Life: 100000Cycles; Color: Black; Min Operating Temperature: -20°C; Max Operating Temperature: 60°C; Throw Configuration: SPST; Operating Force: 1.27N; Packaging: Tape and Reel; Termination: Gull Wing; Voltage Rating (DC): 12V; Package Quantity: 1000; Current Rating: 50mA; Orientation: Straight; Series: PTS645; Length: 6mm; Depth: 9mm; Size: 6mm; Lead Free: Lead Free; RoHS Compliant: Yes; ComponentLink1URL: https://datasheet.ciiva.com/26927/getdatasheetpartid-774114-26927132.pdf?src-supplier=Verical; ComponentLink1Description: https://datasheet.ciiva.com/26927/getdatasheetpartid-774114-26927132.pdf?src-supplier=Verical; Supplier Part Number 1: CKN10880CT-ND
U1 = PMIC_LM2596S-5.0/NOPB: SIMPLE SWITCHER® 4.5V to 40V, 3A Low Component Count Step-Down Regulator 5-DDPAK/TO-263; Manufacturer: TI National Semiconductor; Efficiency: 80%; Number of Outputs: 1; Output Voltage: 5V; Switching Frequency: 173kHz; Quiescent Current: 5mA; Output Type: Fixed; Supplier 1: Digi-Key; Manufacturer Part Number: LM2596S-5.0/NOPB; RoHS: Yes; Category: Power Supply Modules; Pricing 1: 1=7,14000, 10=6,45200, 25=6,15160, 100=5,34150, 250=5,10148, 500=4,95424 (USD); Mount: Surface Mount; Case/Package: TO-263; Number of Pins: 5; Weight: 0.25lb; Contact Plating: Tin,Matte; Min Operating Temperature: -40°C; Max Operating Temperature: 125°C; Min Input Voltage: 4.5V; Output Current: 3A; Packaging: Rail/Tube; Max Output Current: 3A; Max Input Voltage: 40V; Package Quantity: 45; Operating Supply Voltage: 40V; Series: LM2596; Nominal Output Voltage: 5V; Length: 10.16mm; Width: 8.64mm; Height: 4.57mm; Radiation Hardening: No; Lead Free: Contains Lead; REACH SVHC: No SVHC; RoHS Compliant: Yes; ComponentLink1URL: https://datasheet.ciiva.com/14150/jqlm2596x-xx-e-14150651.pdf?src-supplier=Distrelec; ComponentLink1Description: https://datasheet.ciiva.com/14150/jqlm2596x-xx-e-14150651.pdf?src-supplier=Distrelec; ComponentLink2URL: https://datasheet.ciiva.com/27050/836385-27050287.pdf?src-supplier=Jameco; ComponentLink2Description: https://datasheet.ciiva.com/27050/836385-27050287.pdf?src-supplier=Jameco; ComponentLink3URL: https://datasheet.ciiva.com/15112/getdatasheetpartid-112894-15112928.pdf?src-supplier=Verical; ComponentLink3Description: https://datasheet.ciiva.com/15112/getdatasheetpartid-112894-15112928.pdf?src-supplier=Verical; ComponentLink4URL: https://datasheet.ciiva.com/41457/001013813-da-01-en-ic-reg-buc-lm2596s-5-0-nopb-to-263-5-tid-41457757.pdf?src-supplier=Conrad; ComponentLink4Description: https://datasheet.ciiva.com/41457/001013813-da-01-en-ic-reg-buc-lm2596s-5-0-nopb-to-263-5-tid-41457757.pdf?src-supplier=Conrad; ComponentLink5URL: https://datasheet.ciiva.com/22669/1874590-22669463.pdf?src-supplier=Element14; ComponentLink5Description: https://datasheet.ciiva.com/22669/1874590-22669463.pdf?src-supplier=Element14; ComponentLink6URL: https://datasheet.ciiva.com/6596/lm2596-6596343.pdf?src-supplier=Digi-Key; ComponentLink6Description: https://datasheet.ciiva.com/6596/lm2596-6596343.pdf?src-supplier=Digi-Key
U2 U4 U5 = DRIVER_IR2101: IC DRIVER HIGH/LOW SIDE 8SOIC; Manufacturer: Infineon; Manufacturer Part Number: IR2101STRPBF; Number of Drivers: 2; Max Output Current: 360mA; Min Supply Voltage: 10V; Max Supply Voltage: 20V; Fall Time: 90ns; Propagation Delay: 160ns; Channel Type: Independent; Supplier 1: Digi-Key; RoHS: Yes; Category: Gate Drivers; Stock 1: 11317; Pricing 1: 1=2,51000, 10=2,25500, 25=2,12760, 100=1,81290, 250=1,70224, 500=1,48946, 1000=1,48020 (USD); Mount: Surface Mount; Case/Package: SOIC; Number of Pins: 8; Min Operating Temperature: -40°C; Max Operating Temperature: 150°C; Package Quantity: 1; Packaging: Cut Tape; Number of Outputs: 2; Output Current: 360mA; Number of Channels: 2; Length: 0.196inch; Width: 0.157inch; Height: 0.059inch; REACH SVHC: No SVHC; Lead Free: Lead Free; RoHS Compliant: Yes; Halogen Free: Halogen Free
U3 = IC_MCU_ATMEGA328P_AU: IC MCU 8BIT 32KB FLASH 32TQFP; Manufacturer: Microchip; Manufacturer Part Number: ATMEGA328P-AU; Supplier 1: Digi-Key; RoHS: Yes; Category: Microcontrollers; Case/Package: TQFP; RoHS Compliant: Yes; ComponentLink1URL: http://www.farnell.com/datasheets/2047852.pdf?src-supplier=Farnell; ComponentLink1Description: http://www.farnell.com/datasheets/2047852.pdf?src-supplier=Farnell; ComponentLink2URL: https://4donline.ihs.com/images/VipMasterIC/IC/ATML/ATML-S-A0002642585/ATML-S-A0002642585-1.pdf?hkey=6D3A4C79FDBF58556ACFDE234799DDF0&src-supplier=Farnell; ComponentLink2Description: https://4donline.ihs.com/images/VipMasterIC/IC/ATML/ATML-S-A0002642585/ATML-S-A0002642585-1.pdf?hkey=6D3A4C79FDBF58556ACFDE234799DDF0&src-supplier=Farnell; ComponentLink3URL: https://4donline.ihs.com/images/VipMasterIC/IC/ATML/ATML-S-A0002642585/ATML-S-A0002642585-1.pdf?src-supplier=Element14; ComponentLink3Description: https://4donline.ihs.com/images/VipMasterIC/IC/ATML/ATML-S-A0002642585/ATML-S-A0002642585-1.pdf?src-supplier=Element14; ComponentLink4URL: http://www.farnell.com/datasheets/798182.pdf?src-supplier=Newark; ComponentLink4Description: http://www.farnell.com/datasheets/798182.pdf?src-supplier=Newark; ComponentLink5URL: http://www.microchip.com/mymicrochip/filehandler.aspx?ddocname=en589968&src-supplier=Digi-Key; ComponentLink5Description: http://www.microchip.com/mymicrochip/filehandler.aspx?ddocname=en589968&src-supplier=Digi-Key
X1 = CRYSTAL_20.000MHZ_10PF_SMD: Crystal 20MHz ±20ppm (Tol) ±20ppm (Stability) 10pF FUND 100Ohm 4-Pin Ultra Mini-CSMD T/R; Manufacturer: Abracon; Manufacturer Part Number: ABM10-20.000MHZ-E20-T; ESR (Equivalent Series Resistance): 100R; Supplier 1: Digi-Key; RoHS: Yes; Category: Crystals; Stock 1: 927; Pricing 1: 1=1,40000, 10=1,34200, 50=1,31040, 100=1,12320, 500=1,09200 (USD); Mount: Surface Mount; Case/Package: CSMD; Number of Pins: 4; Min Operating Temperature: -20°C; Max Operating Temperature: 70°C; Frequency: 20MHz; Load Capacitance: 10pF; Package Quantity: 1000; Tolerance: 20ppm; Packaging: Tape and Reel; Frequency Stability: 20ppm; Termination: SMD/SMT; Frequency Tolerance: 20ppm; Series Resistance: 100R; Series: ABM10; Operating Frequency: 20 MHz; Length: 2.5mm; Width: 2mm; Height: 0.02inch; Depth: 2mm; REACH SVHC: No SVHC; Lead Free: Lead Free; RoHS Compliant: Yes; ComponentLink1URL: https://datasheet.ciiva.com/15116/getdatasheetpartid-719767-15116692.pdf?src-supplier=Verical; ComponentLink1Description: https://datasheet.ciiva.com/15116/getdatasheetpartid-719767-15116692.pdf?src-supplier=Verical; ComponentLink2URL: https://datasheet.ciiva.com/856/abm10-856517.pdf?src-supplier=Digi-Key; ComponentLink2Description: https://datasheet.ciiva.com/856/abm10-856517.pdf?src-supplier=Digi-Key; ComponentLink3URL: https://datasheet.ciiva.com/3175/abm10-3175612.pdf?src-supplier=Avnet; ComponentLink3Description: https://datasheet.ciiva.com/3175/abm10-3175612.pdf?src-supplier=Avnet; ComponentLink4URL: https://datasheet.ciiva.com/856/abm10-856518.pdf?src-supplier=Digi-Key; ComponentLink4Description: https://datasheet.ciiva.com/856/abm10-856518.pdf?src-supplier=Digi-Key; ComponentLink5URL: https://datasheet.ciiva.com/856/abm10-856519.pdf?src-supplier=Digi-Key; ComponentLink5Description: https://datasheet.ciiva.com/856/abm10-856519.pdf?src-supplier=Digi-Key; ComponentLink6URL: https://datasheet.ciiva.com/16410/abm10-16410922.pdf?src-supplier=Future+Electronics; ComponentLink6Description: https://datasheet.ciiva.com/16410/abm10-16410922.pdf?src-supplier=Future+Electronics; Supplier Part Number 1: 535-9091-1-ND